# EAGLE design StM32F4_dev_board (EAGLE 9.6.2)
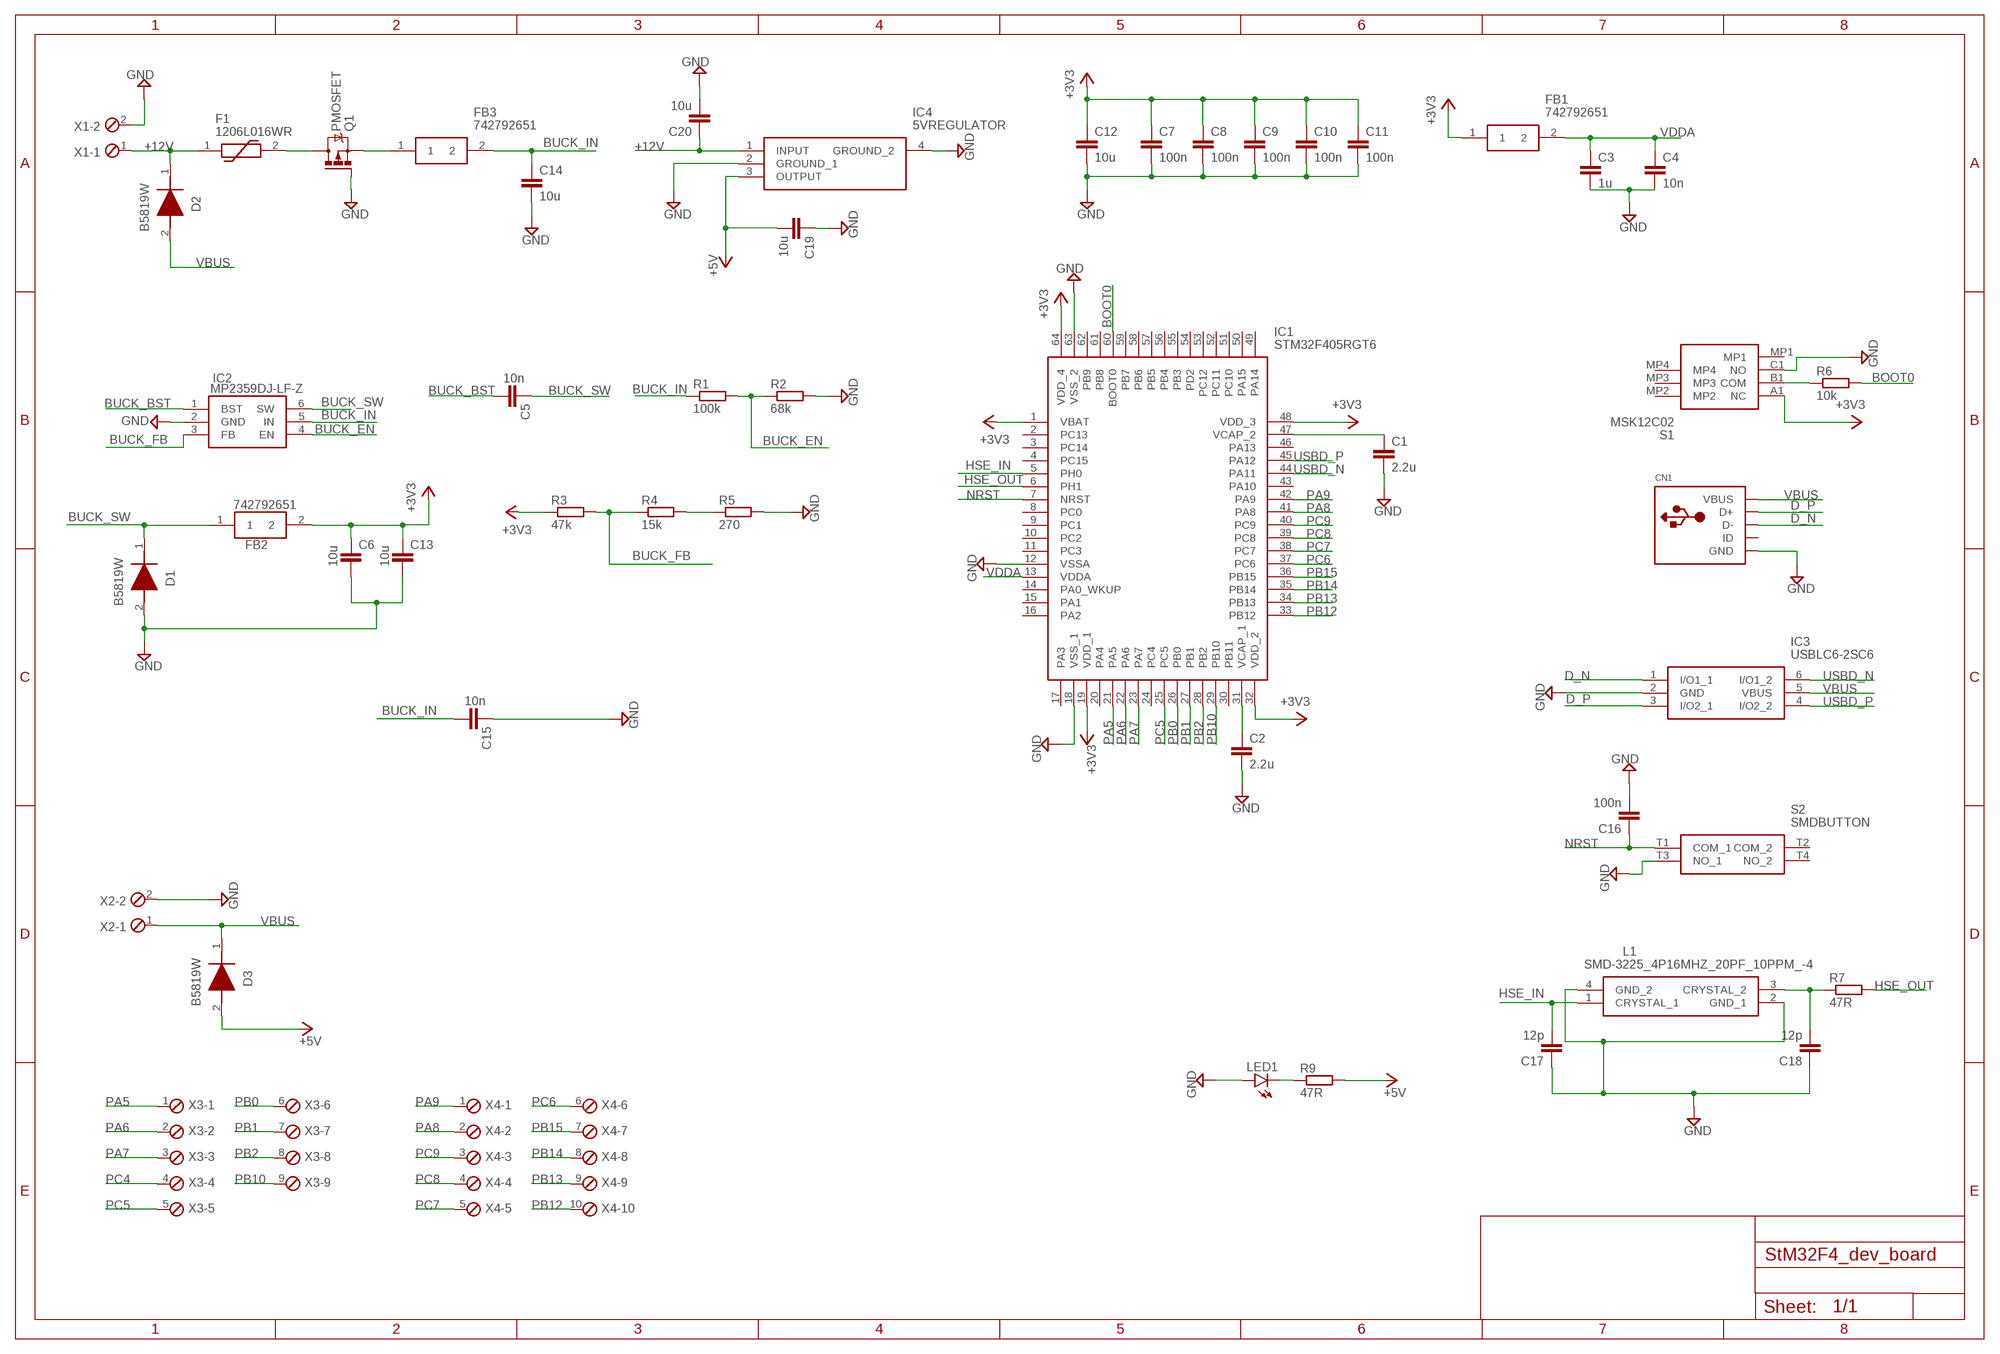
[diagram p0: schematic, sheet 1]

## Parts
C1  2.2u  C-EUC0603  [C0603]
C2  2.2u  C-EUC0603  [C0603]
C3  1u  C-EUC0805  [C0805]
C4  10n  C-EUC0805  [C0805]
C5  10n  C-EUC0805  [C0805]
C6  10u  C-EUC0805  [C0805]
C7  100n  C-EUC0805  [C0805]
C8  100n  C-EUC0805  [C0805]
C9  100n  C-EUC0805  [C0805]
C10  100n  C-EUC0805  [C0805]
C11  100n  C-EUC0805  [C0805]
C12  10u  C-EUC0805  [C0805]
C13  10u  C-EUC0805  [C0805]
C14  10u  C-EUC0805  [C0805]
C15  10n  C-EUC0805  [C0805]
C16  100n  C-EUC0603K  [C0603K]
C17  12p  C-EUC0603K  [C0603K]
C18  12p  C-EUC0603K  [C0603K]
C19  10u  C-EUC0805  [C0805]
C20  10u  C-EUC0805  [C0805]
CN1  USBMINIB  [USB-MINIB]
D1  B5819W  [B5819W]
D2  B5819W  [B5819W]
D3  B5819W  [B5819W]
F1  1206L016WR  [POLYFUSE1206]
FB1  742792651  [BEADC1608X100N]
FB2  742792651  [BEADC1608X100N]
FB3  742792651  [BEADC1608X100N]
IC1  STM32F405RGT6  [STM32F405RTG6]
IC2  MP2359DJ-LF-Z  [MP2359]
IC3  USBLC6-2SC6  [USBLC6]
IC4  5VREGULATOR  [SOT23-5V]
L1  SMD-3225_4P16MHZ_20PF_10PPM_-4  [SMD3225_4P16MHZ20PF10PPM4085]
LED1  LEDCHIP-LED0603  [CHIP-LED0603]
Q1  PMOSFET  PMOSFET_SOT23-GSD  [SOT23]
R1  100k  R-EU_R0805  [R0805]
R2  68k  R-EU_R0805  [R0805]
R3  47k  R-EU_R0805  [R0805]
R4  15k  R-EU_R0805  [R0805]
R5  270  R-EU_R0805  [R0805]
R6  10k  R-EU_R0603  [R0603]
R7  47R  R-EU_R0603  [R0603]
R9  47R  R-EU_R0603  [R0603]
S1  MSK12C02  [MSK12C02]
S2  SMDBUTTON  [SMDBUTTON]
X1  MPT2  [2POL254]
X2  MPT2  [2POL254]
X3  MPT9  [9POL254]
X4  MPT10  [10POL254]

## Nets
+3V3: C6.1 C7.1 C8.1 C9.1 C10.1 C11.1 C12.1 C13.1 FB1.1 FB2.2 IC1.1(VBAT) IC1.19(VDD_1) IC1.32(VDD_2) IC1.48(VDD_3) IC1.64(VDD_4) R3.1 S1.A1(NC)
+5V: C19.2 D3.2(A) IC4.3(OUTPUT) R9.2
+12V: C20.1 D2.1(K) F1.1 IC4.1(INPUT) X1.1
BOOT0: IC1.60(BOOT0) R6.2
BUCK_BST: C5.2 IC2.1(BST)
BUCK_EN: IC2.4(EN) R1.2 R2.1
BUCK_FB: IC2.3(FB) R3.2 R4.1
BUCK_IN: C14.1 C15.2 FB3.2 IC2.5(IN) R1.1
BUCK_SW: C5.1 D1.1(K) FB2.1 IC2.6(SW)
D_N: CN1.D- IC3.1(I/O1_1)
D_P: CN1.D+ IC3.3(I/O2_1)
GND: C1.2 C2.2 C3.2 C4.2 C6.2 C7.2 C8.2 C9.2 C10.2 C11.2 C12.2 C13.2 C14.2 C15.1 C16.2 C17.1 C18.1 C19.1 C20.2 CN1.GND D1.2(A) IC1.12(VSSA) IC1.18(VSS_1) IC1.63(VSS_2) IC2.2(GND) IC3.2(GND) IC4.2(GROUND_1) IC4.4(GROUND_2) L1.2(GND_1) L1.4(GND_2) LED1.A Q1.1(G) R2.2 R5.2 S1.C1(NO) S2.T3(NO_1) X1.2 X2.2
HSE_IN: C17.2 IC1.5(PH0) L1.1(CRYSTAL_1)
HSE_OUT: IC1.6(PH1) R7.2
N$1: C1.1 IC1.47(VCAP_2)
N$2: C2.1 IC1.31(VCAP_1)
N$3: LED1.C R9.1
N$4: R4.2 R5.1
N$5: F1.2 Q1.3(D)
N$6: FB3.1 Q1.2(S)
N$7: R6.1 S1.B1(COM)
N$9: C18.2 L1.3(CRYSTAL_2) R7.1
NRST: C16.1 IC1.7(NRST) S2.T1(COM_1)
PA5: IC1.21(PA5) X3.1
PA6: IC1.22(PA6) X3.2
PA7: IC1.23(PA7) X3.3
PA8: IC1.41(PA8) X4.2
PA9: IC1.42(PA9) X4.1
PB0: IC1.26(PB0) X3.6
PB1: IC1.27(PB1) X3.7
PB2: IC1.28(PB2) X3.8
PB10: IC1.29(PB10) X3.9
PB12: IC1.33(PB12) X4.10
PB13: IC1.34(PB13) X4.9
PB14: IC1.35(PB14) X4.8
PB15: IC1.36(PB15) X4.7
PC4: X3.4
PC5: IC1.25(PC5) X3.5
PC6: IC1.37(PC6) X4.6
PC7: IC1.38(PC7) X4.5
PC8: IC1.39(PC8) X4.4
PC9: IC1.40(PC9) X4.3
USBD_N: IC1.44(PA11) IC3.6(I/O1_2)
USBD_P: IC1.45(PA12) IC3.4(I/O2_2)
VBUS: CN1.VBUS D2.2(A) D3.1(K) IC3.5(VBUS) X2.1
VDDA: C3.1 C4.1 FB1.2 IC1.13(VDDA)
Unconnected: CN1.ID IC1.2(PC13) IC1.3(PC14) IC1.4(PC15) IC1.8(PC0) IC1.9(PC1) IC1.10(PC2) IC1.11(PC3) IC1.14(PA0_WKUP) IC1.15(PA1) IC1.16(PA2) IC1.17(PA3) IC1.20(PA4) IC1.24(PC4) IC1.30(PB11) IC1.43(PA10) IC1.46(PA13) IC1.49(PA14) IC1.50(PA15) IC1.51(PC10) IC1.52(PC11) IC1.53(PC12) IC1.54(PD2) IC1.55(PB3) IC1.56(PB4) IC1.57(PB5) IC1.58(PB6) IC1.59(PB7) IC1.61(PB8) IC1.62(PB9) S1.MP1 S1.MP2 S1.MP3 S1.MP4 S2.T2(COM_2) S2.T4(NO_2)

## Library data of the parts
C1-C20 = rcl:C-EU: CAPACITOR, European symbol; SPICEPREFIX: C
CN1 = adafruit:USB: USB Connectors USBMINIB - Surface Mount Female Mini-B USB Connector 4UConnector: 06564 By microbuilder.eu Thru-hole RA Female Mini-B USB Connector 4UConnector: 18732 By ladyada.net
D1-D3 = B5819W:B5819W: 40V 1A 600mV @ 1A SOD-123 Schottky Barrier Diodes (SBD) Source: Datasheet <https://datasheet.lcsc.com/szlcsc/Changjiang-Electronics-Tech-CJ-B5819W_C8598.pdf>; DESCRIPTION: 40V 1A 600mV @ 1A SOD-123 Schottky Barrier Diodes (SBD); HEIGHT: 1.25mm; MANUFACTURER_NAME: Changjiang Electronics Tech (CJ); MANUFACTURER_PART_NUMBER: B5819W
F1 = 1206L016WR:1206L016WR: Resettable POLYFUSE 100A 30V Source: Datasheet <https://www.littelfuse.com/~/media/electronics/datasheets/resettable_ptcs/littelfuse_ptc_1206l_datasheet.pdf.pdf>; ARROW_PART_NUMBER: 1206L016WR; ARROW_PRICE-STOCK: https://www.arrow.com/en/products/1206l016wr/littelfuse?region=nac; DESCRIPTION: Resettable POLYFUSE 100A 30V; HEIGHT: 1.25mm; MANUFACTURER_NAME: LITTELFUSE; MANUFACTURER_PART_NUMBER: 1206L016WR; MOUSER_PART_NUMBER: 576-1206L016WR; MOUSER_PRICE-STOCK: https://www.mouser.co.uk/ProductDetail/Littelfuse/1206L016WR?qs=PWhpLWeW8weybSDHdny44Q%3D%3D
FB1-FB3 = ferrite bead:742792651: WE-CBF Ferrite Bead 0603 600Ohm 1000mA WE-CBF Ferrite Bead 0603 600Ohm 1000mA Source: Datasheet <https://datasheet.datasheetarchive.com/originals/distributors/Datasheets_SAMA/48062ffb9caf49acf8bdc538db0cfb17.pdf>; DESCRIPTION: WE-CBF Ferrite Bead 0603 600Ohm 1000mA WE-CBF Ferrite Bead 0603 600Ohm 1000mA; HEIGHT: 1mm; MANUFACTURER_NAME: Wurth Elektronik; MANUFACTURER_PART_NUMBER: 742792651; MOUSER_PART_NUMBER: 710-742792651; MOUSER_PRICE-STOCK: https://www.mouser.co.uk/ProductDetail/Wurth-Elektronik/742792651?qs=5twSNpOB8IDs0LGakhqBZQ%3D%3D
IC1 = STM32F405RGT6:STM32F405RGT6: MCU 32-Bit, ARM Cortex M4, 1MB Flash STMicroelectronics STM32F405RGT6, 32bit ARM Cortex M4F Microcontroller, 168MHz, 1024 kB Flash, 64-Pin LQFP Source: Datasheet <http://www.st.com/web/en/resource/technical/document/datasheet/DM00037051.pdf>; ARROW_PART_NUMBER: STM32F405RGT6; ARROW_PRICE-STOCK: https://www.arrow.com/en/products/stm32f405rgt6/stmicroelectronics?region=nac; DESCRIPTION: MCU 32-Bit, ARM Cortex M4, 1MB Flash STMicroelectronics STM32F405RGT6, 32bit ARM Cortex M4F Microcontroller, 168MHz, 1024 kB Flash, 64-Pin LQFP; HEIGHT: 1.6mm; MANUFACTURER_NAME: STMicroelectronics; MANUFACTURER_PART_NUMBER: STM32F405RGT6; MOUSER_PART_NUMBER: 511-STM32F405RGT6; MOUSER_PRICE-STOCK: https://www.mouser.co.uk/ProductDetail/STMicroelectronics/STM32F405RGT6?qs=Z8%252BeY1k3TIKgj7QWsYGpQw%3D%3D
IC2 = MP2359DJ-LF-Z:MP2359DJ-LF-Z: Voltage Regulators - Switching Regulators 1A 24V 1.4MHz Non-sync Buck Source: Datasheet <https://datasheet.datasheetarchive.com/originals/distributors/Datasheets_SAMA/89d986a89c59d1844ef77b6f65b8a4d2.pdf>; DESCRIPTION: Voltage Regulators - Switching Regulators 1A 24V 1.4MHz Non-sync Buck; HEIGHT: 1mm; MANUFACTURER_NAME: Monolithic Power Systems (MPS); MANUFACTURER_PART_NUMBER: MP2359DJ-LF-Z; MOUSER_PART_NUMBER: 946-MP2359DJLFZ; MOUSER_PRICE-STOCK: https://www.mouser.co.uk/ProductDetail/Monolithic-Power-Systems-MPS/MP2359DJ-LF-Z?qs=rC7bBWoQAAkgAaURxgQSyA%3D%3D
IC3 = USBLC6-2SC6:USBLC6-2SC6: TVS Diode Array Uni-Directional USBLC6-2SC6 17V, SOT-23 6-Pin Source: Datasheet <http://www.st.com/st-web-ui/static/active/en/resource/technical/document/datasheet/CD00050750.pdf>; ARROW_PART_NUMBER: USBLC6-2SC6; ARROW_PRICE-STOCK: https://www.arrow.com/en/products/usblc6-2sc6/stmicroelectronics?region=nac; DESCRIPTION: TVS Diode Array Uni-Directional USBLC6-2SC6 17V, SOT-23 6-Pin; HEIGHT: 1.45mm; MANUFACTURER_NAME: STMicroelectronics; MANUFACTURER_PART_NUMBER: USBLC6-2SC6; MOUSER_PART_NUMBER: 511-USBLC6-2SC6; MOUSER_PRICE-STOCK: https://www.mouser.co.uk/ProductDetail/STMicroelectronics/USBLC6-2SC6?qs=po45yt2pPpu%2FhNIlwQdTlg%3D%3D
IC4 = NCV2931AST-5T3G:5VREGULATOR: LDO Regulator Pos 5V 0.1A Automotive 4-Pin(3+Tab) SOT-223 T/R Source: Datasheet <https://www.mouser.com/datasheet/2/308/LM2931-D-30111.pdf>; DESCRIPTION: LDO Regulator Pos 5V 0.1A Automotive 4-Pin(3+Tab) SOT-223 T/R; HEIGHT: 1.8mm; MANUFACTURER_NAME: onsemi; MANUFACTURER_PART_NUMBER: NCV2931AST-5T3G; MOUSER_PART_NUMBER: 863-NCV2931AST-5T3G; MOUSER_PRICE-STOCK: https://www.mouser.co.uk/ProductDetail/ON-Semiconductor/NCV2931AST-5T3G?qs=8sOby8ZxZLGq7jO3LofrqA%3D%3D
L1 = SMD-3225_4p_clock:SMD-3225_4P16MHZ_20PF_10PPM_-4: SMD-3225_4P16MHZ 20PF 10PPM -40~+85 Source: Datasheet <https://datasheet.lcsc.com/szlcsc/Zhejiang-Abel-Elec-SMD-3225-4P-16MHz-20pF-10ppm-40-85_C164049.pdf>; DESCRIPTION: SMD-3225_4P16MHZ 20PF 10PPM -40~+85; HEIGHT: 0.8mm; MANUFACTURER_NAME: TAE(Zhejiang Abel Elec); MANUFACTURER_PART_NUMBER: SMD-3225_4P16MHZ 20PF 10PPM -40~+85℃
LED1 = led:LED: LED OSRAM: - CHIPLED LG R971, LG N971, LY N971, LG Q971, LY Q971, LO R971, LY R971 LH N974, LH R974 LS Q976, LO Q976, LY Q976 LO Q996 - Hyper CHIPLED LW Q18S LB Q993, LB Q99A, LB R99A - SideLED LS A670, LO A670, LY A670, LG A670, LP A670 LB A673, LV A673, LT A673, LW A673 LH A674 LY A675 LS A676, LA A676, LO A676, LY A676, LW A676 LS A679, LY A679, LG A679 - Hyper Micro SIDELED® LS Y876, LA Y876, LO Y876, LY Y876 LT Y87S - SmartLED LW L88C, LW L88S LB L89C, LB L89S, LG L890 LS L89K, LO L89K, LY L89K LS L896, LA L896, LO L896, LY L896 - TOPLED LS T670, LO T670, LY T670, LG T670, LP T670 LSG T670, LSP T670, LSY T670, LOP T670, LYG T670 LG T671, LOG T671, LSG T671 LB T673, LV T673, LT T673, LW T673 LH T674 LS T676, LA T676, LO T676, LY T676, LB T676, LH T676, LSB T676, LW T676 LB T67C, LV T67C, LT T67C, LS T67K, LO T67K, LY T67K, LW E67C LS E67B, LA E67B, LO E67B, LY E67B, LB E67C, LV E67C, LT E67C LW T67C LS T679, LY T679, LG T679 LS T770, LO T770, LY T770, LG T770, LP T770 LB T773, LV T773, LT T773, LW T773 LH T774 LS E675, LA E675, LY E675, LS T675 LS T776, LA T776, LO T776, LY T776, LB T776 LHGB T686 LT T68C, LB T68C - Hyper Mini TOPLED® LB M676 - Mini TOPLED Santana® LG M470 LS M47K, LO M47K, LY M47K Source: http://www.osram.convergy.de LUXEON: - LUMILED® LXK2-PW12-R00, LXK2-PW12-S00, LXK2-PW14-U00, LXK2-PW14-V00 LXK2-PM12-R00, LXK2-PM12-S00, LXK2-PM14-U00 LXK2-PE12-Q00, LXK2-PE12-R00, LXK2-PE12-S00, LXK2-PE14-T00, LXK2-PE14-U00 LXK2-PB12-K00, LXK2-PB12-L00, LXK2-PB12-M00, LXK2-PB14-N00, LXK2-PB14-P00, LXK2-PB14-Q00 LXK2-PR12-L00, LXK2-PR12-M00, LXK2-PR14-Q00, LXK2-PR14-R00 LXK2-PD12-Q00, LXK2-PD12-R00, LXK2-PD12-S00 LXK2-PH12-R00, LXK2-PH12-S00 LXK2-PL12-P00, LXK2-PL12-Q00, LXK2-PL12-R00 Source: www.luxeon.com KINGBRIGHT: KA-3528ASYC Source: www.kingbright.com
Q1 = Transistor:PMOSFET: P-Channel MOSFET - Generic; CATEGORY: Transistor; SUB-CATEGORY: MOSFET; TYPE: P-Channel
R1-R7 R9 = rcl:R-EU_: RESISTOR, European symbol; SPICEPREFIX: R
S1 = MSK12C02 SPDT:MSK12C02: SMD Toggle Switches Source: Datasheet <https://shouhan.en.made-in-china.com/product/xsMEmqgOAXWB/China-Slide-Switch-Msk12c02-Slide-Switch-on-off-2-Position-1p2t-Spdt-Miniature-Horizontal-SMD-7p-Slide-Switch.html>; DESCRIPTION: SMD Toggle Switches; HEIGHT: 1.4mm; MANUFACTURER_NAME: Shou Han; MANUFACTURER_PART_NUMBER: MSK12C02
S2 = SPST Button SMD:SMDBUTTON: Tactile Switches Surface mount tact 6.6mm /4.3mm / Brown Source: Datasheet <https://www.mouser.com/datasheet/2/26/ADTS6-ADTSM-KTSC6-263747-1158247.pdf>; DESCRIPTION: Tactile Switches Surface mount tact 6.6mm /4.3mm / Brown; HEIGHT: 4.3mm; MANUFACTURER_NAME: Apem; MANUFACTURER_PART_NUMBER: ADTSM61NVTR; MOUSER_PART_NUMBER: 642-ADTSM61NVTR; MOUSER_PRICE-STOCK: https://www.mouser.co.uk/ProductDetail/Apem/ADTSM61NVTR?qs=iGLABakYCr8tE6uSJ2f%2FWA%3D%3D
X1 X2 = con-phoenix-254:MPT2: PHOENIX CONNECTOR; OC_FARNELL: unknown; OC_NEWARK: unknown
X3 = con-phoenix-254:MPT9: PHOENIX CONNECTOR; OC_FARNELL: unknown; OC_NEWARK: unknown
X4 = con-phoenix-254:MPT10: PHOENIX CONNECTOR; OC_FARNELL: unknown; OC_NEWARK: unknown

## Board
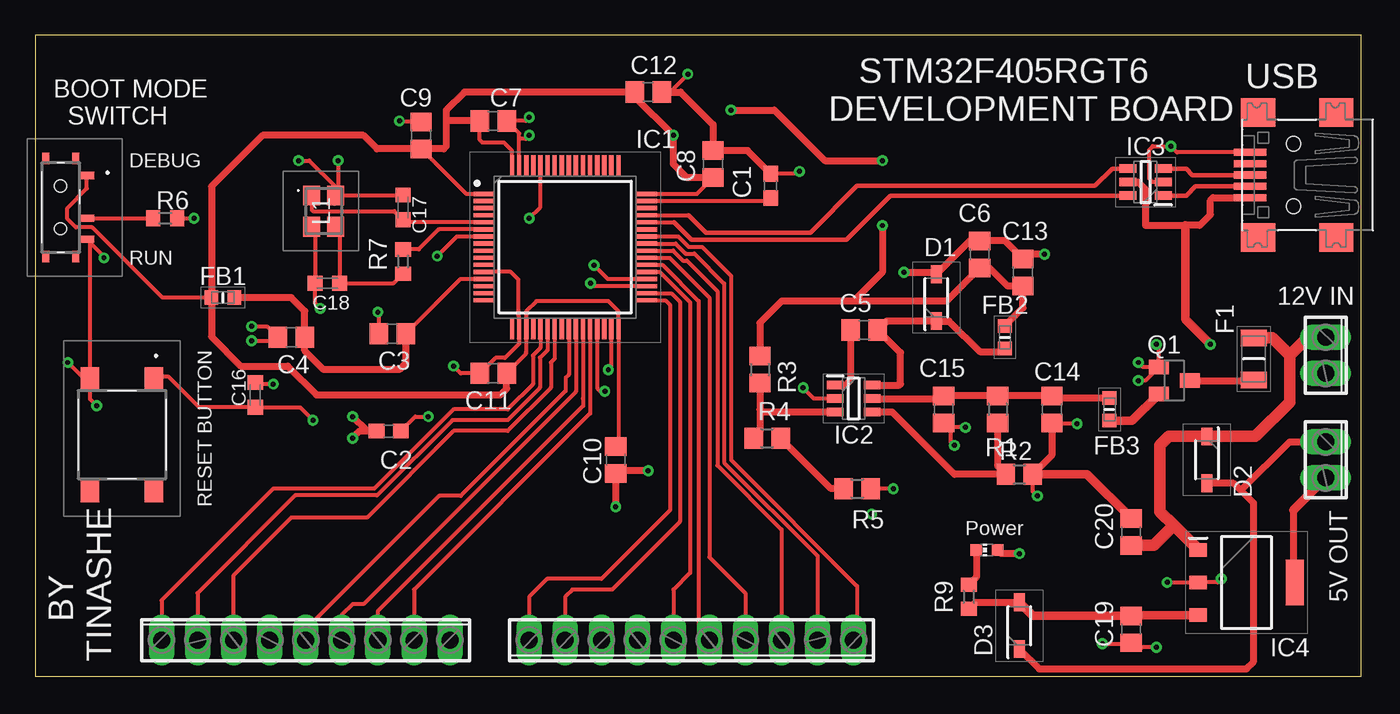
[diagram p1: board, top side]
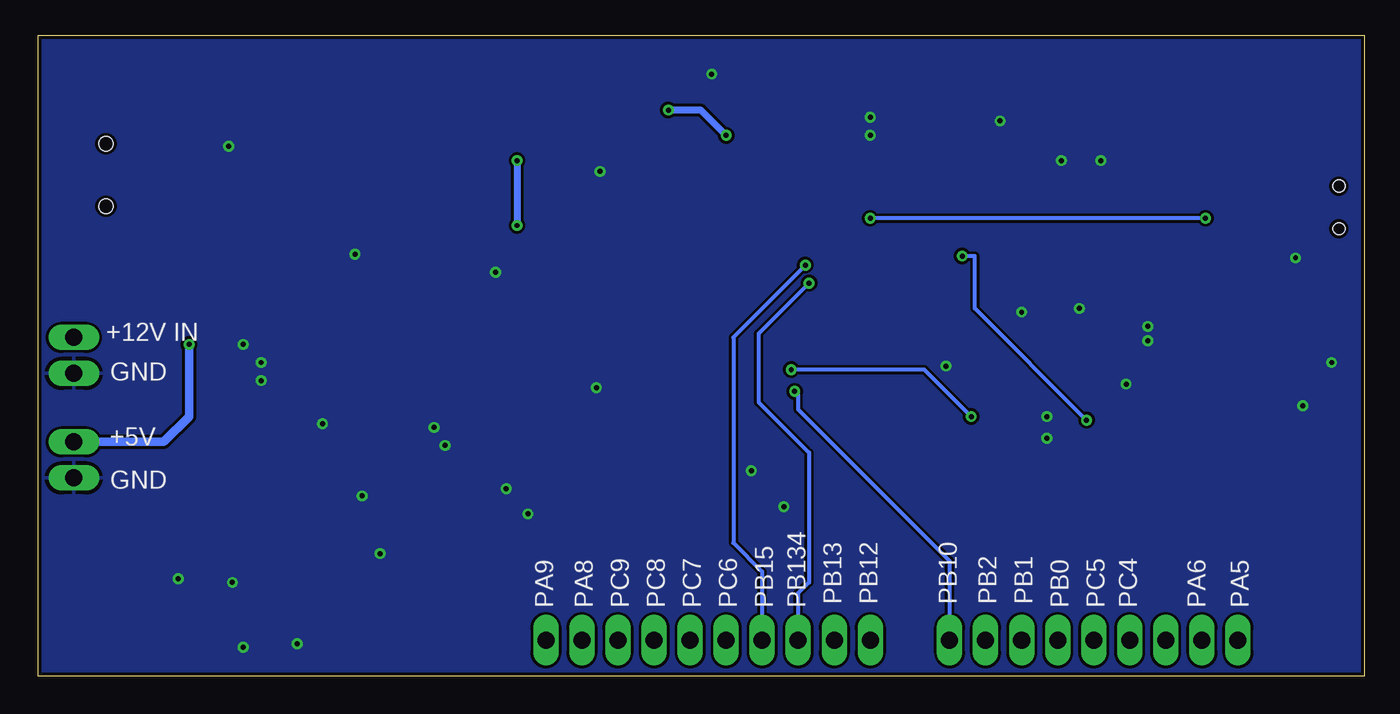
[diagram p2: board, bottom side, seen from below]

Size 93.45 x 45.14 mm. Coordinates in mm from the lower left corner, seen from the top.
Outline: 0,0 93.45,0 93.45,45.14 0,45.14 0,0
Copper layers (1*16): Top 0.035mm / dielectric 1.5mm / Bottom 0.035mm
Design rules "default *": minimum track width 0.25mm, minimum drill 0.35mm, track to track 0.2mm, track to pad 0.2mm, pad to pad 0.2mm, via to via 0.2mm, smd to smd 0.2mm, copper to edge 10mil, drill to drill 0.2mm, minimum pad ring 10mil, minimum via ring 8mil, stop-mask expansion 4mil, vias tented up to drill 0mil, thermal gap 10mil

### Footprints (pad centres in the part's own frame; a part is rotated, then mirrored left to right if it is on the bottom)
C0603 = smd 1.1 x 1: 1 -0.85,0; 2 0.85,0
C0805 = smd 1.3 x 1.5: 1 -0.95,0; 2 0.95,0
C0603K = smd 1.05 x 1.08: 1 -0.875,0; 2 0.875,0
USB-MINIB = smd 0.5 x 2.308: D+ 0,4.064; D- -0.8,4.064; GND 1.6,4.064; ID 0.8,4.064; VBUS -1.6,4.064 | smd 2 x 2.4: GND1 -4.4,-2; GND2 -4.4,3.5; GND3 4.4,3.5; GND4 4.4,-2 | hole 1: -2.2,1; 2.2,1
B5819W = smd 1.25 x 0.75: 1 -1.65,0; 2 1.65,0
POLYFUSE1206 = smd 1.16 x 1.82: 1 -1.475,0; 2 1.475,0
BEADC1608X100N = smd 0.95 x 1: 1 -0.8,0; 2 0.8,0
STM32F405RTG6 = smd 1.475 x 0.3: 1 -5.738,3.75; 2 -5.738,3.25; 3 -5.738,2.75; 4 -5.738,2.25; 5 -5.738,1.75; 6 -5.738,1.25; 7 -5.738,0.75; 8 -5.738,0.25; 9 -5.738,-0.25; 10 -5.738,-0.75; 11 -5.738,-1.25; 12 -5.738,-1.75; 13 -5.738,-2.25; 14 -5.738,-2.75; 15 -5.738,-3.25; 16 -5.738,-3.75; 33 5.738,-3.75; 34 5.738,-3.25; 35 5.738,-2.75; 36 5.738,-2.25; 37 5.738,-1.75; 38 5.738,-1.25; 39 5.738,-0.75; 40 5.738,-0.25; 41 5.738,0.25; 42 5.738,0.75; 43 5.738,1.25; 44 5.738,1.75; 45 5.738,2.25; 46 5.738,2.75; 47 5.738,3.25; 48 5.738,3.75 | smd 0.3 x 1.475: 17 -3.75,-5.738; 18 -3.25,-5.738; 19 -2.75,-5.738; 20 -2.25,-5.738; 21 -1.75,-5.738; 22 -1.25,-5.738; 23 -0.75,-5.738; 24 -0.25,-5.738; 25 0.25,-5.738; 26 0.75,-5.738; 27 1.25,-5.738; 28 1.75,-5.738; 29 2.25,-5.738; 30 2.75,-5.738; 31 3.25,-5.738; 32 3.75,-5.738; 49 3.75,5.738; 50 3.25,5.738; 51 2.75,5.738; 52 2.25,5.738; 53 1.75,5.738; 54 1.25,5.738; 55 0.75,5.738; 56 0.25,5.738; 57 -0.25,5.738; 58 -0.75,5.738; 59 -1.25,5.738; 60 -1.75,5.738; 61 -2.25,5.738; 62 -2.75,5.738; 63 -3.25,5.738; 64 -3.75,5.738
MP2359 = smd 1.15 x 0.6: 1 -1.3,0.95; 2 -1.3,0; 3 -1.3,-0.95; 4 1.3,-0.95; 5 1.3,0; 6 1.3,0.95
USBLC6 = smd 1.2 x 0.6: 1 -1.25,0.95; 2 -1.25,0; 3 -1.25,-0.95; 4 1.25,-0.95; 5 1.25,0; 6 1.25,0.95
SOT23-5V = smd 1.25 x 0.95: 1 -3.4,2.3; 2 -3.4,0; 3 -3.4,-2.3 | smd 1.25 x 3.2: 4 3.4,0
SMD3225_4P16MHZ20PF10PPM4085 = smd 1.4 x 1.2: 1 -1.1,-0.85; 2 1.1,-0.85; 3 1.1,0.85; 4 -1.1,0.85
CHIP-LED0603 = smd 0.8 x 0.8: A 0,-0.75; C 0,0.75
SOT23 = smd 1 x 1.4: 1 -0.95,-1.1; 2 0.95,-1.1; 3 0,1.1
R0805 = smd 1.3 x 1.5: 1 -0.95,0; 2 0.95,0
R0603 = smd 1 x 1.1: 1 -0.85,0; 2 0.85,0
MSK12C02 = smd 0.5 x 1: A1 -2.25,1.85; B1 0.75,1.85; C1 2.25,1.85 | smd 0.8 x 0.5: MP1 3.45,1.05; MP2 3.45,-1.05; MP3 -3.45,-1.05; MP4 -3.45,1.05 | hole 0.85: -1.5,0; 1.5,0
SMDBUTTON = smd 1.55 x 1.3: T1 -3.975,2.25; T2 3.975,2.25; T3 -3.975,-2.25; T4 3.975,-2.25
2POL254 = drill 1.2 long: 1 -1.27,0; 2 1.27,0
9POL254 = drill 1.2 long: 1 -10.16,0; 2 -7.62,0; 3 -5.08,0; 4 -2.54,0; 5 0,0; 6 2.54,0; 7 5.08,0; 8 7.62,0; 9 10.16,0
10POL254 = drill 1.2 long: 1 -11.43,0; 2 -8.89,0; 3 -6.35,0; 4 -3.81,0; 5 -1.27,0; 6 1.27,0; 7 3.81,0; 8 6.35,0; 9 8.89,0; 10 11.43,0

### Placement (x,y rotation side)
C1  51.82,34.54 90 top
C2  24.89,17.27 180 top
C3  25.15,24.13 180 top
C4  18.03,23.88 180 top
C5  58.42,24.38 180 top
C6  66.55,29.72 90 top
C7  32.26,39.12 0 top
C8  47.75,36.07 90 top
C9  27.18,38.1 90 top
C10  40.89,15.24 270 top
C11  32.26,21.34 180 top
C12  43.18,41.15 0 top
C13  69.6,28.45 90 top
C14  71.63,18.8 270 top
C15  64.01,18.8 90 top
C16  15.49,19.81 90 top
C17  25.91,33.02 270 top
C18  20.57,27.69 0 top
C19  77.22,3.3 90 top
C20  77.22,10.16 90 top
CN1  89.66,35.31 90 top
D1  63.5,26.67 90 top
D2  82.55,15.24 270 top
D3  69.34,3.56 90 top
F1  85.85,22.35 270 top
FB1  13.21,26.67 0 top
FB2  68.33,23.88 90 top
FB3  75.69,18.8 90 top
IC1  37.34,30.23 0 top
IC2  57.66,19.56 0 top
IC3  78.23,34.8 180 top
IC4  85.34,6.6 0 top
L1  20.32,32.77 270 top
LED1  67.06,8.89 90 top
Q1  80.26,20.83 270 top
R1  67.82,18.8 270 top
R2  69.34,14.22 0 top
R3  51.05,21.59 270 top
R4  51.56,16.76 0 top
R5  57.91,13.21 0 top
R6  9.14,32.26 0 top
R7  25.91,29.21 90 top
R9  65.79,5.59 270 top
S1  1.78,33.02 270 top
S2  6.1,17.02 270 top
X1  90.93,22.61 270 top
X2  90.93,15.24 270 top
X3  19.05,2.54 0 top
X4  46.23,2.54 180 top

### Tracks (layer width: path | path; a pad name or v marks a point on that pad's centre or on a via)
+3V3  (via drill 0.35)
  Top 0.28: IC1.48 46.61,33.98 C8.1 | FB1.1 8.96,26.67 4.01,31.61 2.84,31.61 2.24,32.21 2.24,32.98 3.63,34.36 S1.A1 | C10.1 41.09,16.38 IC1.32 41.09,25.71 40.39,26.42 35.31,26.42 34.59,25.7 IC1.19 34.59,22.82 34.57,22.8 34.57,22.7 C11.1 | IC1.64 33.59,37.02 33.02,37.59 31.5,37.59 31.31,37.78 C7.1 | C9.1 30.35,33.98 IC1.1
  Top 0.508: 57.66,26.42 64.2,26.42 C6.1 67.24,28.77 68.51,27.5 C13.1 69.6,25.95 FB2.2 | 57.66,26.42 52.58,26.42 51.05,24.89 R3.1 | 28.96,39.12 28.96,39.88 30.23,41.15 C12.1 42.23,40.83 v44.96,38.1 44.96,36.07 45.91,35.12 C8.1 | 28.96,39.12 28.96,37.34 28.77,37.15 C9.1 24.06,37.15 23.11,38.1 16,38.1 12.41,34.51 FB1.1 12.41,23.91 14.48,21.84 17.78,21.84 19.81,19.81 32.77,19.81 33.21,20.25 C11.1 | C7.1 28.96,39.12 | v49.02,39.88 52.07,39.88 55.63,36.32 v59.69,36.32 | v59.69,31.75 59.69,28.45 57.66,26.42
  Bottom 0.508: v44.96,38.1 46.74,39.88 v49.02,39.88 | v59.69,36.32 v59.69,31.75
+5V
  Top 0.508: R9.2 66.25,5.21 D3.2
  Top 0.61: IC4.3 77.27,4.3 C19.2 70.3,4.25 D3.2
+12V
  Top 0.813: 88.39,22.61 88.39,19.3 85.98,16.89 D2.1 79.88,16.89 79.25,16.26 79.25,11.6 80.22,10.63 | 88.39,22.61 87.17,23.83 F1.1 | 88.39,22.61 89.66,23.88 X1.1 | 80.22,10.63 IC4.1 | 80.22,10.63 78.81,9.21 C20.1
BOOT0  (via drill 0.35)
  Top 0.28: R6.2 v11.18,32.26 | v34.8,32.26 35.59,33.05 IC1.60
  Bottom 0.28: v11.18,32.26 v34.8,32.26
BUCK_BST
  Top 0.508: IC2.1 57.08,20.51 57.47,20.89 C5.2
BUCK_EN
  Top 0.508: IC2.4 60.39,18.61 64.77,14.22 R2.1 67.82,14.8 R1.2
BUCK_FB
  Top 0.508: R3.2 51.05,18.8 | 51.05,18.8 51.05,17.21 R4.1 | IC2.3 51.24,18.61 51.05,18.8
BUCK_IN
  Top 0.508: FB3.2 71.78,19.6 C14.1 R1.1 C15.2 63.82,19.56 IC2.5
BUCK_SW
  Top 0.508: IC2.6 60.89,20.51 60.96,20.57 60.96,22.79 C5.1 60.01,25.02 D1.1 64.39,25.02 66.55,22.86 68.11,22.86 FB2.1
D_N
  Top 0.305: CN1.D- 81.75,34.51 81.09,33.85 IC3.1
D_P
  Top 0.305: CN1.D+ 81.53,35.31 81.09,35.75 IC3.3
GND  (via drill 0.35)
  Top 0.28: L1.2 19.7,31.44 C18.1 19.7,26.27 v20.07,25.91 | C17.1 25.88,33.87 L1.4 21.34,34.03 v21.34,36.32 | IC1.63 34.09,37.85 | 34.09,37.85 34.09,38.24 C7.2 34.54,39.12 v34.8,39.37 | v4.32,19.05 3.85,19.52 3.85,20.57 | 3.85,20.57 S2.T3 3.85,30.55 S1.C1 4.83,29.57 v4.83,29.46 | v2.29,22.1 3.81,20.57 3.85,20.57 | v24.13,25.65 24.2,25.59 C3.2 | v18.54,36.32 19.3,36.32 21.08,34.54 21.08,33.27 | v53.85,35.56 53.68,35.39 C1.2 | v45.97,42.42 44.7,41.15 C12.2 | v34.8,38.1 34.54,37.85 34.09,37.85 | IC3.2 78.74,34.8 78.49,35.05 78.49,37.08 78.74,37.34 v80.01,37.34 80.44,36.91 CN1.GND | Q1.1 78.04,21.78 v77.72,22.1 | Q1.1 79.16,23.2 v78.99,23.37 | Q1.1 78.21,20.83 v77.72,20.83 | v73.41,17.78 71.69,17.78 C14.2 | v70.61,12.7 70.29,13.02 R2.2 | v79.76,6.6 IC4.2 83.31,6.6 v83.57,6.86 | v78.99,2.03 77.98,2.03 | 77.98,2.03 77.54,2.03 C19.1 | v75.18,2.29 77.72,2.29 77.98,2.03 | v60.45,13.21 R5.2 | IC2.2 54.86,19.56 v54.1,20.32 | v65.53,17.53 64.52,17.53 | 64.52,17.53 64.33,17.53 C15.1 | v64.77,16.26 64.52,16.51 64.52,17.53 | v29.46,21.84 29.97,21.34 C11.2 31.33,21.34 32.42,22.43 33.09,22.43 34.09,23.42 IC1.18 34.08,24.5 34.08,25.37 34.04,25.41 34.04,27.94 33.5,28.48 IC1.12 | C9.2 25.72,39.05 v25.65,39.12 | v16.76,20.57 15.61,20.57 C16.2 | v15.24,24.64 16.32,24.64 C4.2 16.83,23.62 v15.24,23.62
  Top 0.508: C14.2 71.63,15.56 R2.2 | C1.2 50.19,37.02 C8.2 47.75,38.86 45.47,41.15 C12.2 | 65.91,30.73 D1.2 63.37,28.45 v61.21,28.45 | C6.2 68.33,30.67 C13.2 69.92,29.72 v71.12,29.72 | v43.18,14.48 41.08,14.48 C10.2 v40.89,11.94 | v22.35,16.76 22.86,17.27 C2.2 23.37,17.27 v22.35,18.29 | 88.65,11.68 88.65,6.7 IC4.4 | v69.34,8.64 68.06,8.64 LED1.A
  Top 0.61: X2.2 88.65,11.68 | R2.2 74.1,14.22 C20.2
  other vias: 58.93,11.43
  pour Bottom: -4.57,47.5 -4.57,-0.25 4.57,-9.4 95.5,-9.4 105.92,1.02 105.92,45.72 99.31,52.32 0.25,52.32
HSE_IN
  Top 0.28: L1.1 19.47,32.85 19.56,32.77 25.29,32.77 C17.2 26.08,31.98 IC1.5
HSE_OUT
  Top 0.28: IC1.6 28.43,31.48 27.01,30.06 R7.2
N$1
  Top 0.28: IC1.47 51.6,33.48 C1.1
N$2  (via drill 0.35)
  Top 0.28: C2.1 26.76,18.29 v27.69,18.29 | v40.37,21.59 40.59,21.81 IC1.31
  Bottom 0.28: v27.69,18.29 30.99,21.59 v40.37,21.59
N$3
  Top 0.508: LED1.C 66.31,6.96 R9.1
N$4
  Top 0.508: R5.1 56.07,13.21 R4.2
N$5
  Top 0.508: F1.2 85.8,20.83 Q1.3
N$6
  Top 0.61: Q1.2 77.28,18 FB3.1
N$7
  Top 0.28: S1.B1 R6.1
N$9
  Top 0.28: R7.1 25.23,27.69 C18.2 21.45,31.39 L1.3
NRST  (via drill 0.35)
  Top 0.28: S2.T1 8.44,21.08 9.4,21.08 11.54,18.94 C16.1 18.66,18.94 v19.56,18.03 | v28.32,29.59 29.71,30.98 IC1.7
  Bottom 0.28: v19.56,18.03 27.43,25.91 27.43,29.59 v28.32,29.59
PA5
  Top 0.28: IC1.21 35.59,23.14 35.05,22.61 35.05,20.57 33.27,18.8 29.46,18.8 23.88,13.21 16.76,13.21 8.89,5.33 X3.1
PA6
  Top 0.28: IC1.22 36.09,22.96 35.56,22.43 35.56,20.32 33.27,18.03 29.38,18.03 24.07,12.73 18.32,12.73 11.43,5.84 X3.2
PA7
  Top 0.28: IC1.23 36.59,22.36 36.32,22.1 36.32,20.32 33.27,17.27 29.46,17.27 23.37,11.18 18.03,11.18 14.1,7.24 13.97,7.11 X3.3
PA8
  Top 0.28: IC1.41 45.11,30.48 45.83,29.76 46.44,29.76 48.54,27.66 48.54,15.04 55.12,8.46 X4.2
PA9
  Top 0.28: IC1.42 45.29,30.98 46.02,30.24 46.97,30.24 49.02,28.19 49.02,15.24 57.91,6.35 57.91,2.79 X4.1
PB0
  Top 0.28: X3.6 21.59,4.32 22.35,5.08 23.11,5.08 38.09,20.05 IC1.26
PB1
  Top 0.28: X3.7 24.13,4.57 38.61,19.05 38.61,19.56 38.59,19.58 IC1.27
PB2
  Top 0.28: X3.8 26.67,6.1 39.09,18.51 IC1.28
PB10  (via drill 0.35)
  Top 0.28: IC1.29 39.59,20.28 39.81,20.07 v40.13,20.07
  Bottom 0.28: v40.13,20.07 39.88,19.81 39.88,18.8 29.21,8.13 X3.9
PB12
  Top 0.28: IC1.33 44.39,26.48 44.7,26.16 44.7,11.68 39.88,6.86 36.07,6.86 34.8,5.59 X4.10
PB13
  Top 0.28: IC1.34 44.82,26.98 45.42,26.37 45.42,10.88 40.64,6.1 37.85,6.1 37.34,5.59 X4.9
PB14  (via drill 0.35)
  Top 0.28: IC1.35 39.33,27.48 v39.12,27.69
  Bottom 0.28: v39.12,27.69 42.67,24.13 42.67,19.3 39.12,15.75 39.12,6.6 39.88,5.84 X4.8
PB15  (via drill 0.35)
  Top 0.28: IC1.36 40.35,27.98 v39.37,28.96
  Bottom 0.28: v39.37,28.96 44.45,23.88 44.45,9.4 42.42,7.37 X4.7
PC5
  Top 0.28: IC1.25 37.59,21.25 37.37,21.03 37.37,20.09 29.97,12.7 28.45,12.7 19.05,3.3 X3.5
PC6
  Top 0.28: IC1.37 44,28.48 46.14,26.33 46.14,7.28 44.96,6.1 X4.6
PC7
  Top 0.28: IC1.38 44.18,28.98 46.74,26.42 46.74,3.3 X4.5
PC8
  Top 0.28: IC1.39 44.69,29.48 47.5,26.67 47.5,8.38 50.04,5.84 X4.4
PC9
  Top 0.28: IC1.40 44.93,29.98 45.63,29.28 45.9,29.28 48.06,27.12 48.06,14.84 52.58,10.33 X4.3
USBD_N
  Top 0.28: IC1.44 44.99,31.98
  Top 0.305: 44.99,31.98 46.23,30.73 57.15,30.73 60.26,33.85 IC3.6
USBD_P
  Top 0.28: IC1.45 46.01,32.48
  Top 0.305: IC3.4 75.88,35.75 74.68,34.54 57.91,34.54 54.61,31.24 47.24,31.24 46.01,32.48
VBUS  (via drill 0.35)
  Top 0.508: D3.1 70.74,0.51 85.34,0.51 85.85,1.02 85.85,12.19 84.96,13.08 | 84.96,13.08 84.45,13.59 D2.2 | 84.96,13.08 88.39,16.51 X2.1 | IC3.5 77.72,34.8 78.23,34.29 78.23,31.75 81.03,31.75 82.04,31.75 82.8,32.51 82.8,33.53 82.98,33.71 CN1.VBUS
  Top 0.61: 81.03,31.75 81.03,25.15 v82.8,23.37
  Bottom 0.61: v82.8,23.37 82.8,18.29 84.58,16.51 X2.1
VDDA
  Top 0.28: IC1.13 29.94,27.98 C3.1
  Top 0.508: C3.1 26.1,22.03 25.65,21.59 20.32,21.59 18.98,22.93 C4.1 18.98,25.72 18.03,26.67 FB1.2

### Text on the board
tNames: USB | BOOT MODE / SWITCH | STM32F405RGT6 / DEVELOPMENT BOARD | DEBUG | RUN | 12V IN | RESET BUTTON | 5V OUT | Power | BY / TINASHE
bNames: +12V IN | GND | +5V | GND | PA5 | PA6 | PC4 | PC5 | PB0 | PB1 | PB2 | PB10 | PB12 | PB13 | PB134 | PB15 | PC6 | PC7 | PC8 | PC9 | PA8 | PA9